# Altium schematic sheet Ada - Sensor - daugher board 4.0.SchDoc
size A3; DocumentNumber: 3; SheetNumber: 3; SheetTotal: 3
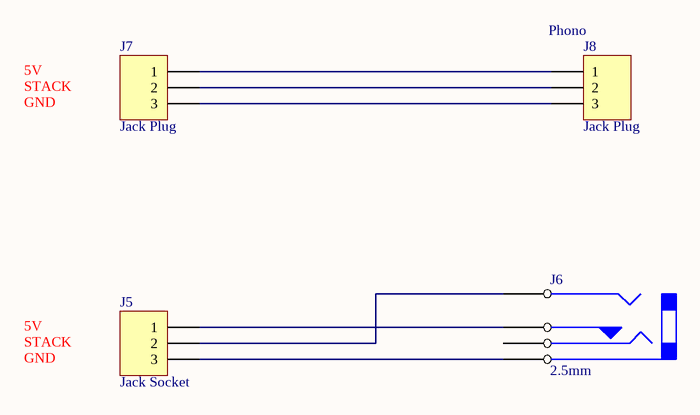
[diagram p0: Ada - Sensor - daugher board 4.0.SchDoc]

## Parts
J5  Jack Socket  [SIP3]
J6  value 2.5mm  [2.5mm socket TRI001]  (hidden comment: 2.5mm PHONEJACK STEREO TRI001)
J7  Jack Plug  [sip3]
J8  Jack Plug  value Phono  [DC_JACK_PCB_MOUNT]

## Nets
NetJ5_1: J5.1 J6.2
NetJ5_2: J5.2 J6.4
NetJ5_3: J5.3 J6.1
NetJ7_1: J7.1 J8.1
NetJ7_2: J7.2 J8.2
NetJ7_3: J7.3 J8.3

Not connected (* = marked no-connect by the designer): J6 3

## Notes on the sheet
- STACK
- 5V
- GND
- N.B. LED Cathodes are identified, assembler to refer to part datasheet for correct orientation
- NOTES
- Project Name:
- Project Number:
- Title:
- Size:
- Date:
- A3
- Number:
- Time:
- Sheet
- Drawn by:
- of
- Version:
- File:

## Library data of the parts
J5 = Header 3: Header, 3-Pin
J6 = 2.5mm PHONEJACK STEREO TRI001: 2.5mm PHONEJACK STEREO; Manufacturer: PRO SIGNAL; Manuf Part #: PSG01539; FEC#: 1280745; Part No.: 1280745; Supplier: FEC
J7 = Header 3: Header, 3-Pin; Value: N/F
J8 = Header 3: Header, 3-Pin; Manufacturer: BKL; Manuf Part #: 1107002  EAN-13: 2050000222993; Part No.: 50-1493; Supplier: Rapid